# Altium schematic sheet BQ34110.SchDoc
size Tabloid; Organization: Altium Limited; Address1: L3, 12a Rodborough Rd; Address2: Frenchs Forest; Address3: NSW; Address4: Australia 2086
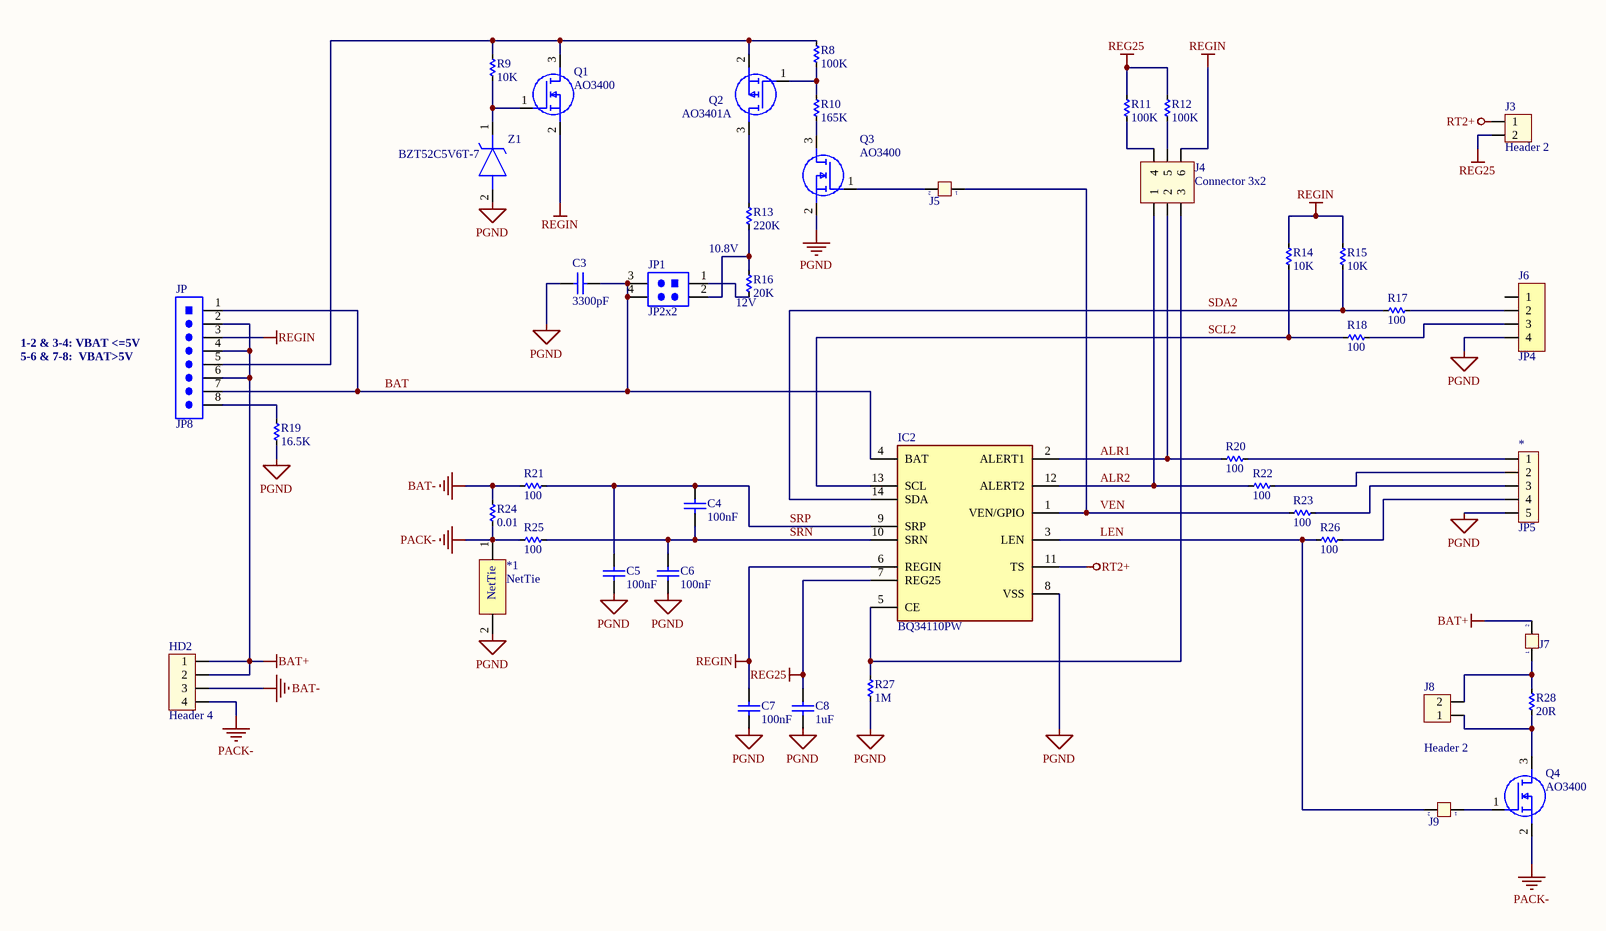
[diagram p0: BQ34110.SchDoc]

## Parts
*  JP5  [JP5]
*1  NetTie  [NetTie]
C3  3300pF  [0805 CAP]
C4  100nF  [0805 CAP]
C5  100nF  [0805 CAP]
C6  100nF  [0805 CAP]
C7  100nF  [0805 CAP]
C8  1uF  [0805 CAP]
HD2  Header 4  [HED4]
IC2  BQ34110PW  [SOP65P640X120-14N]
J3  Header 2  [HED2B]
J4  Connector 3x2  [JP3x2]
J5  Jumper 2  [JP2]  (value not drawn)
J6  JP4  [JP4-C1T]
J7  Jumper 2  [JP2]  (value not drawn)
J8  Header 2  [HED2B]
J9  Jumper 2  [JP2]  (value not drawn)
JP  JP8  [JP8]
JP1  JP2x2  [JP2X2]
Q1  AO3400  [SOT95P280X125-3N]
Q2  AO3401A  [SOT95P280X125-3N]
Q3  AO3400  [SOT95P280X125-3N]
Q4  AO3400  [SOT95P280X125-3N]
R8  100K  [RES-SMD-0805]
R9  10K  [RES-SMD-0805]
R10  165K  [RES-SMD-0805]
R11  100K  [RES-SMD-0805]
R12  100K  [RES-SMD-0805]
R13  220K  [RES-SMD-0805]
R14  10K  [RES-SMD-0805]
R15  10K  [RES-SMD-0805]
R16  20K  [RES-SMD-0805]
R17  100  [RES-SMD-0805]
R18  100  [RES-SMD-0805]
R19  16.5K  [RES-SMD-0805]
R20  100  [RES-SMD-0805]
R21  100  [RES-SMD-0805]
R22  100  [RES-SMD-0805]
R23  100  [RES-SMD-0805]
R24  0.01  [RES-SMD-0805]
R25  100  [RES-SMD-0805]
R26  100  [RES-SMD-0805]
R27  1M  [RES-SMD-0805]
R28  20R  [RES-SMD-2512]
Z1  BZT52C5V6T-7  [SODFL1608X65N]

## Nets
BAT+: HD2.1 HD2.2 J7.2 JP.2 JP.4 JP.6
BAT-: HD2.3 R21.1 R24.1
PACK-: *1.1 HD2.4 Q4.2(S) R24.2 R25.1
PGND: *.5 *1.2 C3.2 C5.2 C6.2 C7.2 C8.2 IC2.8(VSS) J6.4 Q3.2(S) R19.1 R27.2 Z1.2(A)
REG25: C8.1 IC2.7(REG25) J3.2 R11.2 R12.2
REGIN: C7.1 IC2.6(REGIN) J4.3(6) JP.3 Q1.2(S) R14.2 R15.2
RT2+: IC2.11(TS) J3.1
ALR1: IC2.2(ALERT1) J4.5(2) R20.1
ALR2: IC2.12(ALERT2) J4.1 R22.1
BAT: C3.1 IC2.4(BAT) JP.1 JP.7 JP1.3 JP1.4
LEN: IC2.3(LEN) J9.2 R26.1
SCL2: IC2.13(SCL) R14.1 R18.1
SDA2: IC2.14(SDA) R15.1 R17.1
SRN: C4.2 C6.1 IC2.10(SRN) R25.2
SRP: C4.1 C5.1 IC2.9(SRP) R21.2
VEN: IC2.1(VEN/GPIO) J5.1 R23.1
Net*_1: *.1 R20.2
Net*_2: *.2 R22.2
Net*_3: *.3 R23.2
Net*_4: *.4 R26.2
NetIC2_5: IC2.5(CE) J4.6(3) R27.1
NetJ4_2: J4.2(5) R12.1
NetJ4_4: J4.4 R11.1
NetJ5_2: J5.2 Q3.1(G)
NetJ6_2: J6.2 R17.2
NetJ6_3: J6.3 R18.2
NetJ7_1: J7.1 J8.2 R28.2
NetJ8_1: J8.1 Q4.3(D) R28.1
NetJ9_1: J9.1 Q4.1(G)
NetJP1_1: JP1.1 R16.1
NetJP1_2: JP1.2 R13.1 R16.2
NetJP_5: JP.5 Q1.3(D) Q2.2(S) R8.2 R9.2
NetJP_8: JP.8 R19.2
NetQ1_1: Q1.1(G) R9.1 Z1.1(K)
NetQ2_1: Q2.1(G) R8.1 R10.2
NetQ2_3: Q2.3(D) R13.2
NetQ3_3: Q3.3(D) R10.1

Not connected (* = marked no-connect by the designer): J6 1

## Notes on the sheet
- 10.8V
- 1-2 & 3-4: VBAT <=5V
- 5-6 & 7-8:  VBAT>5V
- (near R16) 12V
- Title
- Size:
- Date:
- DATA LOGGER 31May
- Tabloid
- Number:
- Time:
- Revision:
- Sheet
- of
- File:

## Library data of the parts
C3-C8 = CAP CERAMIC: Published: 8-Jun-2000; LatestRevisionDate: 17-Jul-2002; LatestRevisionNote: Re-released for DXP Platform.; PackageReference: RAD-0.3; Publisher: Altium Limited
HD2 = Hed4: Header 4 (Green); Value: Header 4
IC2 = BQ34110PW: Integrated Circuit; Manufacturer_Name: Texas Instruments; Datasheet Link: http://www.ti.com/lit/gpn/bq34110; Height: 1.2mm; Manufacturer_Part_Number: BQ34110PW; Mouser Part Number: 595-BQ34110PW; Mouser Price/Stock: https://www.mouser.co.uk/ProductDetail/Texas-Instruments/BQ34110PW?qs=OEYMhS7p3YbAd6vB%252BTGmNQ%3D%3D; Arrow Part Number: BQ34110PW; Arrow Price/Stock: https://www.arrow.com/en/products/bq34110pw/texas-instruments
J3 J8 = Hed2: Header 2 (Green); Value: Header 2
J4 = JP3x2: Value: Connector 3x2
J5 J7 J9 = JP 2: Value: JP 2
J6 = JP4: WR-PHD 2.54 mm Angled Socket Header; Manufacturer: W¨¹rth Elektronik eiSos GmbH; partNo: 613004143121; ComponentLink1 Description: Manufacturer; ComponentLink2 Description: Datasheet; NoPins: 04; Created Date: 29 March 2013; ComponentLink1URL: http://www.we-online.com; ComponentLink2URL: http://katalog.we-online.de/em/datasheet/6130xx143121.pdf; Created by: Karrer Zheng
Q1 Q3 Q4 = AO3400: MOSFET (N-Channel); Manufacturer_Name: Alpha & Omega Semiconductors; Datasheet Link: http://aosmd.com/res/data_sheets/AO3400.pdf; Height: 1.25mm; Manufacturer_Part_Number: AO3400; Arrow Part Number: AO3400; Arrow Price/Stock: https://www.arrow.com/en/products/ao3400/alpha-and-omega-semiconductor
Q2 = AO3401A: MOSFET (P-Channel); Manufacturer_Name: Alpha & Omega Semiconductors; Datasheet Link: http://www.aosmd.com/pdfs/datasheet/AO3401A.pdf; Height: 1.25mm; Manufacturer_Part_Number: AO3401A; Arrow Part Number: AO3401A; Arrow Price/Stock: https://www.arrow.com/en/products/ao3401a/alpha-and-omega-semiconductor
R8-R28 = Res-SMD: Resistor; Manufacturer: Generic Components; Class: Passive; Published: 08/06/2000; Publisher: Altium Hobart Technology Centre
Z1 = BZT52C5V6T-7: Zener Diode; Manufacturer_Name: Diodes Inc.; Datasheet Link: https://www.mouser.com/datasheet/2/115/ds30502-1142513.pdf; Height: 0.65mm; Manufacturer_Part_Number: BZT52C5V6T-7; Mouser Part Number: 621-BZT52C5V6T-7; Mouser Price/Stock: https://www.mouser.co.uk/ProductDetail/Diodes-Incorporated/BZT52C5V6T-7/?qs=zLeapIUCO8Tm%252BIuaCPAdkQ%3D%3D; Arrow Part Number: BZT52C5V6T-7; Arrow Price/Stock: https://www.arrow.com/en/products/bzt52c5v6t-7/diodes-incorporated